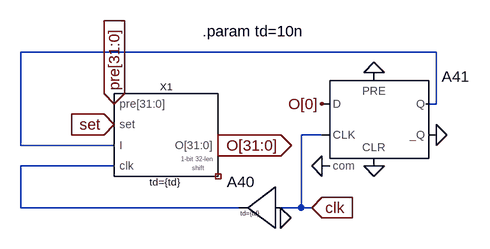
[diagram p0: schematic ring-shift_reg-1bit-32len.asc]
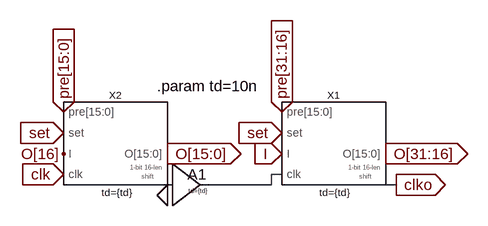
[diagram p1: sub-circuit shift_reg-1bit-32len.asc]
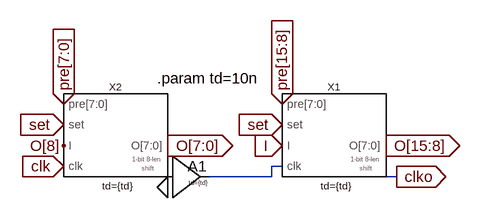
[diagram p2: sub-circuit shift_reg-1bit-16len.asc]
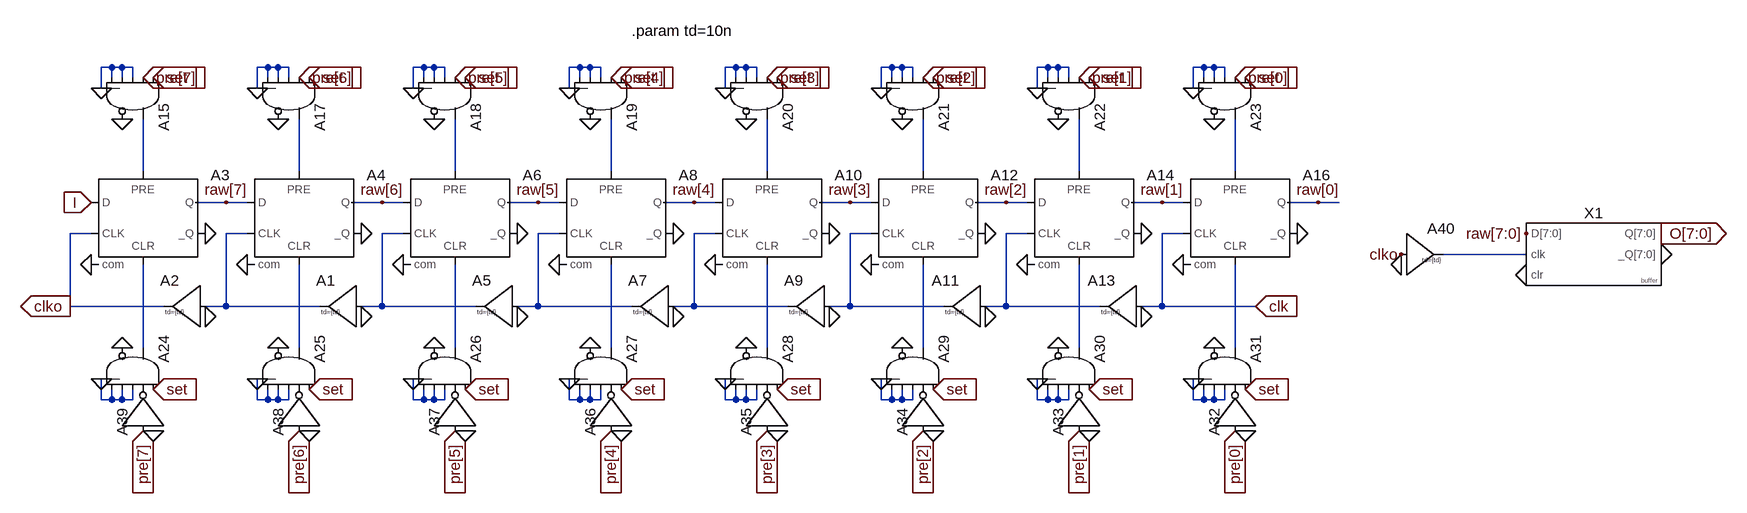
[diagram p3: sub-circuit shift_reg-1bit-8len.asc]
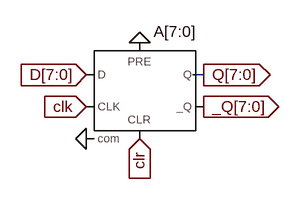
[diagram p4: sub-circuit dbuf_8bit.asc]
ring-shift_reg-1bit-32len.asc, the LTspice schematic file:
Version 4
SHEET 1 2236 680
WIRE 1680 -160 1040 -160
WIRE 1680 -80 1680 -160
WIRE 1680 -80 1664 -80
WIRE 1504 -32 1472 -32
WIRE 1040 -16 1040 -160
WIRE 1184 -16 1040 -16
WIRE 1184 16 1040 16
WIRE 1040 80 1040 16
WIRE 1376 80 1040 80
WIRE 1472 80 1472 -32
WIRE 1472 80 1440 80
WIRE 1488 80 1472 80
FLAG 1488 80 clk
IOPIN 1488 80 In
FLAG 1344 -16 O[31:0]
IOPIN 1344 -16 Out
FLAG 1184 -80 pre[31:0]
IOPIN 1184 -80 In
FLAG 1184 -48 set
IOPIN 1184 -48 In
FLAG 1440 96 0
FLAG 1504 16 0
FLAG 1584 16 0
FLAG 1584 -128 0
FLAG 1680 -32 0
FLAG 1504 -80 O[0]
SYMBOL Digital\\buf1 1440 16 M0
WINDOW 3 32 73 Left 0
SYMATTR Value td={td}
SYMATTR InstName A40
SYMBOL Digital\\dflop 1584 -128 R0
SYMATTR InstName A41
SYMBOL shift_reg-1bit-32len 1264 -32 R0
WINDOW 39 -2 83 Bottom 1
SYMATTR InstName X1
SYMATTR SpiceLine td={td}
TEXT 1320 -192 Left 2 !.param td=10n

shift_reg-1bit-32len.asc, the sub-circuit schematic file:
Version 4
SHEET 1 2236 680
WIRE 736 64 720 64
WIRE 720 80 720 64
WIRE 720 80 624 80
WIRE 912 80 896 80
FLAG 400 64 clk
IOPIN 400 64 In
FLAG 896 32 O[31:16]
IOPIN 896 32 Out
FLAG 736 -32 pre[31:16]
IOPIN 736 -32 In
FLAG 736 0 set
IOPIN 736 0 In
FLAG 912 80 clko
IOPIN 912 80 Out
FLAG 736 32 I
IOPIN 736 32 In
FLAG 560 96 0
FLAG 560 32 O[15:0]
IOPIN 560 32 Out
FLAG 400 -32 pre[15:0]
IOPIN 400 -32 In
FLAG 400 0 set
IOPIN 400 0 In
FLAG 400 32 O[16]
SYMBOL Digital\\buf1 560 16 R0
WINDOW 3 32 73 Left 0
WINDOW 0 31 48 Left 2
SYMATTR Value td={td}
SYMATTR InstName A1
SYMBOL shift_reg-1bit-16len 816 16 R0
WINDOW 39 2 86 Bottom 1
SYMATTR InstName X1
SYMATTR SpiceLine td={td}
SYMBOL shift_reg-1bit-16len 480 16 R0
WINDOW 39 2 86 Bottom 1
SYMATTR InstName X2
SYMATTR SpiceLine td={td}
TEXT 544 -72 Left 2 !.param td=10n

shift_reg-1bit-16len.asc, the sub-circuit schematic file:
Version 4
SHEET 1 2236 680
WIRE 736 64 720 64
WIRE 720 80 720 64
WIRE 720 80 624 80
WIRE 912 80 896 80
FLAG 400 64 clk
IOPIN 400 64 In
FLAG 896 32 O[15:8]
IOPIN 896 32 Out
FLAG 736 -32 pre[15:8]
IOPIN 736 -32 In
FLAG 736 0 set
IOPIN 736 0 In
FLAG 912 80 clko
IOPIN 912 80 Out
FLAG 736 32 I
IOPIN 736 32 In
FLAG 560 96 0
FLAG 560 32 O[7:0]
IOPIN 560 32 Out
FLAG 400 -32 pre[7:0]
IOPIN 400 -32 In
FLAG 400 0 set
IOPIN 400 0 In
FLAG 400 32 O[8]
SYMBOL shift_reg-1bit-8len 816 16 R0
WINDOW 39 3 88 Bottom 1
SYMATTR SpiceLine td={td}
SYMATTR InstName X1
SYMBOL Digital\\buf1 560 16 R0
WINDOW 3 32 73 Left 0
WINDOW 0 31 48 Left 2
SYMATTR Value td={td}
SYMATTR InstName A1
SYMBOL shift_reg-1bit-8len 480 16 R0
WINDOW 39 3 88 Bottom 1
SYMATTR SpiceLine td={td}
SYMATTR InstName X2
TEXT 544 -72 Left 2 !.param td=10n

shift_reg-1bit-8len.asc, the sub-circuit schematic file:
Version 4
SHEET 1 2616 680
WIRE 96 -288 80 -288
WIRE 112 -288 96 -288
WIRE 128 -288 112 -288
WIRE 336 -288 320 -288
WIRE 352 -288 336 -288
WIRE 368 -288 352 -288
WIRE 576 -288 560 -288
WIRE 592 -288 576 -288
WIRE 608 -288 592 -288
WIRE 816 -288 800 -288
WIRE 832 -288 816 -288
WIRE 848 -288 832 -288
WIRE 1056 -288 1040 -288
WIRE 1072 -288 1056 -288
WIRE 1088 -288 1072 -288
WIRE 1296 -288 1280 -288
WIRE 1312 -288 1296 -288
WIRE 1328 -288 1312 -288
WIRE 1536 -288 1520 -288
WIRE 1552 -288 1536 -288
WIRE 1568 -288 1552 -288
WIRE 1776 -288 1760 -288
WIRE 1792 -288 1776 -288
WIRE 1808 -288 1792 -288
WIRE 96 -272 96 -288
WIRE 112 -272 112 -288
WIRE 128 -272 128 -288
WIRE 336 -272 336 -288
WIRE 352 -272 352 -288
WIRE 368 -272 368 -288
WIRE 576 -272 576 -288
WIRE 592 -272 592 -288
WIRE 608 -272 608 -288
WIRE 816 -272 816 -288
WIRE 832 -272 832 -288
WIRE 848 -272 848 -288
WIRE 1056 -272 1056 -288
WIRE 1072 -272 1072 -288
WIRE 1088 -272 1088 -288
WIRE 1296 -272 1296 -288
WIRE 1312 -272 1312 -288
WIRE 1328 -272 1328 -288
WIRE 1536 -272 1536 -288
WIRE 1552 -272 1552 -288
WIRE 1568 -272 1568 -288
WIRE 1776 -272 1776 -288
WIRE 1792 -272 1792 -288
WIRE 1808 -272 1808 -288
WIRE 80 -256 80 -288
WIRE 96 -256 80 -256
WIRE 320 -256 320 -288
WIRE 336 -256 320 -256
WIRE 560 -256 560 -288
WIRE 576 -256 560 -256
WIRE 800 -256 800 -288
WIRE 816 -256 800 -256
WIRE 1040 -256 1040 -288
WIRE 1056 -256 1040 -256
WIRE 1280 -256 1280 -288
WIRE 1296 -256 1280 -256
WIRE 1520 -256 1520 -288
WIRE 1536 -256 1520 -256
WIRE 1760 -256 1760 -288
WIRE 1776 -256 1760 -256
WIRE 144 -128 144 -208
WIRE 384 -128 384 -208
WIRE 624 -128 624 -208
WIRE 864 -128 864 -208
WIRE 1104 -128 1104 -208
WIRE 1344 -128 1344 -208
WIRE 1584 -128 1584 -208
WIRE 1824 -128 1824 -208
WIRE 272 -80 224 -80
WIRE 304 -80 272 -80
WIRE 512 -80 464 -80
WIRE 544 -80 512 -80
WIRE 752 -80 704 -80
WIRE 784 -80 752 -80
WIRE 992 -80 944 -80
WIRE 1024 -80 992 -80
WIRE 1232 -80 1184 -80
WIRE 1264 -80 1232 -80
WIRE 1472 -80 1424 -80
WIRE 1504 -80 1472 -80
WIRE 1712 -80 1664 -80
WIRE 1744 -80 1712 -80
WIRE 1952 -80 1904 -80
WIRE 1984 -80 1952 -80
WIRE 64 -32 32 -32
WIRE 304 -32 272 -32
WIRE 544 -32 512 -32
WIRE 784 -32 752 -32
WIRE 1024 -32 992 -32
WIRE 1264 -32 1232 -32
WIRE 1504 -32 1472 -32
WIRE 1744 -32 1712 -32
WIRE 2272 0 2144 0
WIRE 32 80 32 -32
WIRE 176 80 32 80
WIRE 272 80 272 -32
WIRE 272 80 240 80
WIRE 416 80 272 80
WIRE 512 80 512 -32
WIRE 512 80 480 80
WIRE 656 80 512 80
WIRE 752 80 752 -32
WIRE 752 80 720 80
WIRE 896 80 752 80
WIRE 992 80 992 -32
WIRE 992 80 960 80
WIRE 1136 80 992 80
WIRE 1232 80 1232 -32
WIRE 1232 80 1200 80
WIRE 1376 80 1232 80
WIRE 1472 80 1472 -32
WIRE 1472 80 1440 80
WIRE 1616 80 1472 80
WIRE 1712 80 1712 -32
WIRE 1712 80 1680 80
WIRE 1856 80 1712 80
WIRE 144 144 144 16
WIRE 384 144 384 16
WIRE 624 144 624 16
WIRE 864 144 864 16
WIRE 1104 144 1104 16
WIRE 1344 144 1344 16
WIRE 1584 144 1584 16
WIRE 1824 144 1824 16
WIRE 96 192 80 192
WIRE 336 192 320 192
WIRE 576 192 560 192
WIRE 816 192 800 192
WIRE 1056 192 1040 192
WIRE 1296 192 1280 192
WIRE 1536 192 1520 192
WIRE 1776 192 1760 192
WIRE 80 224 80 192
WIRE 96 224 96 208
WIRE 96 224 80 224
WIRE 112 224 112 208
WIRE 112 224 96 224
WIRE 128 224 128 208
WIRE 128 224 112 224
WIRE 320 224 320 192
WIRE 336 224 336 208
WIRE 336 224 320 224
WIRE 352 224 352 208
WIRE 352 224 336 224
WIRE 368 224 368 208
WIRE 368 224 352 224
WIRE 560 224 560 192
WIRE 576 224 576 208
WIRE 576 224 560 224
WIRE 592 224 592 208
WIRE 592 224 576 224
WIRE 608 224 608 208
WIRE 608 224 592 224
WIRE 800 224 800 192
WIRE 816 224 816 208
WIRE 816 224 800 224
WIRE 832 224 832 208
WIRE 832 224 816 224
WIRE 848 224 848 208
WIRE 848 224 832 224
WIRE 1040 224 1040 192
WIRE 1056 224 1056 208
WIRE 1056 224 1040 224
WIRE 1072 224 1072 208
WIRE 1072 224 1056 224
WIRE 1088 224 1088 208
WIRE 1088 224 1072 224
WIRE 1280 224 1280 192
WIRE 1296 224 1296 208
WIRE 1296 224 1280 224
WIRE 1312 224 1312 208
WIRE 1312 224 1296 224
WIRE 1328 224 1328 208
WIRE 1328 224 1312 224
WIRE 1520 224 1520 192
WIRE 1536 224 1536 208
WIRE 1536 224 1520 224
WIRE 1552 224 1552 208
WIRE 1552 224 1536 224
WIRE 1568 224 1568 208
WIRE 1568 224 1552 224
WIRE 1760 224 1760 192
WIRE 1776 224 1776 208
WIRE 1776 224 1760 224
WIRE 1792 224 1792 208
WIRE 1792 224 1776 224
WIRE 1808 224 1808 208
WIRE 1808 224 1792 224
FLAG 1856 80 clk
IOPIN 1856 80 In
FLAG 240 96 0
FLAG 1952 -80 raw[0]
FLAG 144 -272 pre[7]
IOPIN 144 -272 In
FLAG 64 16 0
FLAG 240 -32 0
FLAG 480 96 0
FLAG 384 -272 pre[6]
IOPIN 384 -272 In
FLAG 304 16 0
FLAG 480 -32 0
FLAG 720 96 0
FLAG 624 -272 pre[5]
IOPIN 624 -272 In
FLAG 544 16 0
FLAG 720 -32 0
FLAG 960 96 0
FLAG 864 -272 pre[4]
IOPIN 864 -272 In
FLAG 784 16 0
FLAG 960 -32 0
FLAG 1200 96 0
FLAG 1104 -272 pre[3]
IOPIN 1104 -272 In
FLAG 1024 16 0
FLAG 1200 -32 0
FLAG 1440 96 0
FLAG 1344 -272 pre[2]
IOPIN 1344 -272 In
FLAG 1264 16 0
FLAG 1440 -32 0
FLAG 1680 96 0
FLAG 1584 -272 pre[1]
IOPIN 1584 -272 In
FLAG 1504 16 0
FLAG 1680 -32 0
FLAG 1824 -272 pre[0]
IOPIN 1824 -272 In
FLAG 1744 16 0
FLAG 1920 -32 0
FLAG 160 -272 set
IOPIN 160 -272 In
FLAG 80 -256 0
FLAG 400 -272 set
IOPIN 400 -272 In
FLAG 320 -256 0
FLAG 640 -272 set
IOPIN 640 -272 In
FLAG 560 -256 0
FLAG 880 -272 set
IOPIN 880 -272 In
FLAG 800 -256 0
FLAG 1120 -272 set
IOPIN 1120 -272 In
FLAG 1040 -256 0
FLAG 1360 -272 set
IOPIN 1360 -272 In
FLAG 1280 -256 0
FLAG 1600 -272 set
IOPIN 1600 -272 In
FLAG 1520 -256 0
FLAG 1840 -272 set
IOPIN 1840 -272 In
FLAG 1760 -256 0
FLAG 144 272 pre[7]
IOPIN 144 272 In
FLAG 384 272 pre[6]
IOPIN 384 272 In
FLAG 624 272 pre[5]
IOPIN 624 272 In
FLAG 864 272 pre[4]
IOPIN 864 272 In
FLAG 1104 272 pre[3]
IOPIN 1104 272 In
FLAG 1344 272 pre[2]
IOPIN 1344 272 In
FLAG 1584 272 pre[1]
IOPIN 1584 272 In
FLAG 1824 272 pre[0]
IOPIN 1824 272 In
FLAG 160 208 set
IOPIN 160 208 In
FLAG 80 192 0
FLAG 400 208 set
IOPIN 400 208 In
FLAG 320 192 0
FLAG 640 208 set
IOPIN 640 208 In
FLAG 560 192 0
FLAG 880 208 set
IOPIN 880 208 In
FLAG 800 192 0
FLAG 1120 208 set
IOPIN 1120 208 In
FLAG 1040 192 0
FLAG 1360 208 set
IOPIN 1360 208 In
FLAG 1280 192 0
FLAG 1600 208 set
IOPIN 1600 208 In
FLAG 1520 192 0
FLAG 1840 208 set
IOPIN 1840 208 In
FLAG 1760 192 0
FLAG 112 -208 0
FLAG 352 -208 0
FLAG 592 -208 0
FLAG 832 -208 0
FLAG 1072 -208 0
FLAG 1312 -208 0
FLAG 1552 -208 0
FLAG 1792 -208 0
FLAG 112 144 0
FLAG 352 144 0
FLAG 592 144 0
FLAG 832 144 0
FLAG 1072 144 0
FLAG 1312 144 0
FLAG 1552 144 0
FLAG 1792 144 0
FLAG 1840 272 0
FLAG 1600 272 0
FLAG 1360 272 0
FLAG 1120 272 0
FLAG 880 272 0
FLAG 640 272 0
FLAG 400 272 0
FLAG 160 272 0
FLAG 64 -80 I
IOPIN 64 -80 In
FLAG 32 80 clko
IOPIN 32 80 Out
FLAG 2272 32 0
FLAG 2080 16 0
FLAG 2080 0 clko
FLAG 2272 -32 raw[7:0]
FLAG 2480 0 0
FLAG 2480 -32 O[7:0]
IOPIN 2480 -32 Out
FLAG 1712 -80 raw[1]
FLAG 1472 -80 raw[2]
FLAG 1232 -80 raw[3]
FLAG 992 -80 raw[4]
FLAG 752 -80 raw[5]
FLAG 512 -80 raw[6]
FLAG 272 -80 raw[7]
SYMBOL Digital\\buf1 240 16 M0
WINDOW 3 32 73 Left 0
SYMATTR Value td={td}
SYMATTR InstName A2
SYMBOL Digital\\dflop 144 -128 R0
SYMATTR InstName A3
SYMBOL Digital\\buf1 480 16 M0
WINDOW 3 32 73 Left 0
SYMATTR Value td={td}
SYMATTR InstName A1
SYMBOL Digital\\dflop 384 -128 R0
SYMATTR InstName A4
SYMBOL Digital\\buf1 720 16 M0
WINDOW 3 32 73 Left 0
SYMATTR Value td={td}
SYMATTR InstName A5
SYMBOL Digital\\dflop 624 -128 R0
SYMATTR InstName A6
SYMBOL Digital\\buf1 960 16 M0
WINDOW 3 32 73 Left 0
SYMATTR Value td={td}
SYMATTR InstName A7
SYMBOL Digital\\dflop 864 -128 R0
SYMATTR InstName A8
SYMBOL Digital\\buf1 1200 16 M0
WINDOW 3 32 73 Left 0
SYMATTR Value td={td}
SYMATTR InstName A9
SYMBOL Digital\\dflop 1104 -128 R0
SYMATTR InstName A10
SYMBOL Digital\\buf1 1440 16 M0
WINDOW 3 32 73 Left 0
SYMATTR Value td={td}
SYMATTR InstName A11
SYMBOL Digital\\dflop 1344 -128 R0
SYMATTR InstName A12
SYMBOL Digital\\buf1 1680 16 M0
WINDOW 3 32 73 Left 0
SYMATTR Value td={td}
SYMATTR InstName A13
SYMBOL Digital\\dflop 1584 -128 R0
SYMATTR InstName A14
SYMBOL Digital\\dflop 1824 -128 R0
SYMATTR InstName A16
SYMBOL Digital\\and 192 -240 R90
SYMATTR InstName A15
SYMBOL Digital\\and 432 -240 R90
SYMATTR InstName A17
SYMBOL Digital\\and 672 -240 R90
SYMATTR InstName A18
SYMBOL Digital\\and 912 -240 R90
SYMATTR InstName A19
SYMBOL Digital\\and 1152 -240 R90
SYMATTR InstName A20
SYMBOL Digital\\and 1392 -240 R90
SYMATTR InstName A21
SYMBOL Digital\\and 1632 -240 R90
SYMATTR InstName A22
SYMBOL Digital\\and 1872 -240 R90
SYMATTR InstName A23
SYMBOL Digital\\and 192 176 M270
SYMATTR InstName A24
SYMBOL Digital\\and 432 176 M270
SYMATTR InstName A25
SYMBOL Digital\\and 672 176 M270
SYMATTR InstName A26
SYMBOL Digital\\and 912 176 M270
SYMATTR InstName A27
SYMBOL Digital\\and 1152 176 M270
SYMATTR InstName A28
SYMBOL Digital\\and 1392 176 M270
SYMATTR InstName A29
SYMBOL Digital\\and 1632 176 M270
SYMATTR InstName A30
SYMBOL Digital\\and 1872 176 M270
SYMATTR InstName A31
SYMBOL Digital\\inv 1760 272 R270
WINDOW 0 -8 32 Left 2
SYMATTR InstName A32
SYMBOL Digital\\inv 1520 272 R270
WINDOW 0 -8 32 Left 2
SYMATTR InstName A33
SYMBOL Digital\\inv 1280 272 R270
WINDOW 0 -8 32 Left 2
SYMATTR InstName A34
SYMBOL Digital\\inv 1040 272 R270
WINDOW 0 -8 32 Left 2
SYMATTR InstName A35
SYMBOL Digital\\inv 800 272 R270
WINDOW 0 -8 32 Left 2
SYMATTR InstName A36
SYMBOL Digital\\inv 560 272 R270
WINDOW 0 -8 32 Left 2
SYMATTR InstName A37
SYMBOL Digital\\inv 320 272 R270
WINDOW 0 -8 32 Left 2
SYMATTR InstName A38
SYMBOL Digital\\inv 80 272 R270
WINDOW 0 -8 32 Left 2
SYMATTR InstName A39
SYMBOL dbuf_8bit 2368 0 R0
SYMATTR InstName X1
SYMBOL Digital\\buf1 2080 -64 R0
WINDOW 3 32 73 Left 0
SYMATTR Value td={td}
SYMATTR InstName A40
TEXT 896 -344 Left 2 !.param td=10n

dbuf_8bit.asc, the sub-circuit schematic file:
Version 4
SHEET 1 880 680
WIRE 224 128 208 128
FLAG 48 224 0
FLAG 224 128 Q[7:0]
IOPIN 224 128 Out
FLAG 224 176 _Q[7:0]
IOPIN 224 176 Out
FLAG 128 224 clr
IOPIN 128 224 In
FLAG 48 128 D[7:0]
IOPIN 48 128 In
FLAG 48 176 clk
IOPIN 48 176 In
FLAG 128 80 0
SYMBOL Digital\\dflop 128 80 R0
WINDOW 0 21 -17 Left 2
SYMATTR InstName A[7:0]

The netlist it stands for:
* ring-shift_reg-1bit-32len.asc
A40 clk 0 0 0 0 0 N002 0 BUF td={td}
A41 O[0] 0 clk 0 0 0 N001 0 DFLOP
XX1 N002 pre[31] pre[30] pre[29] pre[28] pre[27] pre[26] pre[25] pre[24] pre[23] pre[22] pre[21] pre[20] pre[19] pre[18] pre[17] pre[16] pre[15] pre[14] pre[13] pre[12] pre[11] pre[10] pre[9] pre[8] pre[7] pre[6] pre[5] pre[4] pre[3] pre[2] pre[1] pre[0] O[31] O[30] O[29] O[28] O[27] O[26] O[25] O[24] O[23] O[22] O[21] O[20] O[19] O[18] O[17] O[16] O[15] O[14] O[13] O[12] O[11] O[10] O[9] O[8] O[7] O[6] O[5] O[4] O[3] O[2] O[1] O[0] set N001 NC_01 shift_reg-1bit-32len params: td={td}

* block symbol definitions
.subckt shift_reg-1bit-32len clk pre[31] pre[30] pre[29] pre[28] pre[27] pre[26] pre[25] pre[24] pre[23] pre[22] pre[21] pre[20] pre[19] pre[18] pre[17] pre[16] pre[15] pre[14] pre[13] pre[12] pre[11] pre[10] pre[9] pre[8] pre[7] pre[6] pre[5] pre[4] pre[3] pre[2] pre[1] pre[0] O[31] O[30] O[29] O[28] O[27] O[26] O[25] O[24] O[23] O[22] O[21] O[20] O[19] O[18] O[17] O[16] O[15] O[14] O[13] O[12] O[11] O[10] O[9] O[8] O[7] O[6] O[5] O[4] O[3] O[2] O[1] O[0] set I clko
A1 P001 0 0 0 0 0 N001 0 BUF td={td}
XX1 N001 pre[31] pre[30] pre[29] pre[28] pre[27] pre[26] pre[25] pre[24] pre[23] pre[22] pre[21] pre[20] pre[19] pre[18] pre[17] pre[16] O[31] O[30] O[29] O[28] O[27] O[26] O[25] O[24] O[23] O[22] O[21] O[20] O[19] O[18] O[17] O[16] set I clko shift_reg-1bit-16len params: td={td}
XX2 clk pre[15] pre[14] pre[13] pre[12] pre[11] pre[10] pre[9] pre[8] pre[7] pre[6] pre[5] pre[4] pre[3] pre[2] pre[1] pre[0] O[15] O[14] O[13] O[12] O[11] O[10] O[9] O[8] O[7] O[6] O[5] O[4] O[3] O[2] O[1] O[0] set O[16] P001 shift_reg-1bit-16len params: td={td}
.param td=10n
.ends shift_reg-1bit-32len

.subckt shift_reg-1bit-16len clk pre[15] pre[14] pre[13] pre[12] pre[11] pre[10] pre[9] pre[8] pre[7] pre[6] pre[5] pre[4] pre[3] pre[2] pre[1] pre[0] O[15] O[14] O[13] O[12] O[11] O[10] O[9] O[8] O[7] O[6] O[5] O[4] O[3] O[2] O[1] O[0] set I clko
XX1 N001 pre[15] pre[14] pre[13] pre[12] pre[11] pre[10] pre[9] pre[8] O[15] O[14] O[13] O[12] O[11] O[10] O[9] O[8] set I clko shift_reg-1bit-8len params: td={td}
A1 P001 0 0 0 0 0 N001 0 BUF td={td}
XX2 clk pre[7] pre[6] pre[5] pre[4] pre[3] pre[2] pre[1] pre[0] O[7] O[6] O[5] O[4] O[3] O[2] O[1] O[0] set O[8] P001 shift_reg-1bit-8len params: td={td}
.param td=10n
.ends shift_reg-1bit-16len

.subckt shift_reg-1bit-8len clk pre[7] pre[6] pre[5] pre[4] pre[3] pre[2] pre[1] pre[0] O[7] O[6] O[5] O[4] O[3] O[2] O[1] O[0] set I clko
A2 N009 0 0 0 0 0 clko 0 BUF td={td}
A3 I 0 clko N001 N016 0 raw[7] 0 DFLOP
A1 N010 0 0 0 0 0 N009 0 BUF td={td}
A4 raw[7] 0 N009 N002 N017 0 raw[6] 0 DFLOP
A5 N011 0 0 0 0 0 N010 0 BUF td={td}
A6 raw[6] 0 N010 N003 N018 0 raw[5] 0 DFLOP
A7 N012 0 0 0 0 0 N011 0 BUF td={td}
A8 raw[5] 0 N011 N004 N019 0 raw[4] 0 DFLOP
A9 N013 0 0 0 0 0 N012 0 BUF td={td}
A10 raw[4] 0 N012 N005 N020 0 raw[3] 0 DFLOP
A11 N014 0 0 0 0 0 N013 0 BUF td={td}
A12 raw[3] 0 N013 N006 N021 0 raw[2] 0 DFLOP
A13 clk 0 0 0 0 0 N014 0 BUF td={td}
A14 raw[2] 0 N014 N007 N022 0 raw[1] 0 DFLOP
A16 raw[1] 0 clk N008 N023 0 raw[0] 0 DFLOP
A15 set pre[7] 0 0 0 0 N001 0 AND
A17 set pre[6] 0 0 0 0 N002 0 AND
A18 set pre[5] 0 0 0 0 N003 0 AND
A19 set pre[4] 0 0 0 0 N004 0 AND
A20 set pre[3] 0 0 0 0 N005 0 AND
A21 set pre[2] 0 0 0 0 N006 0 AND
A22 set pre[1] 0 0 0 0 N007 0 AND
A23 set pre[0] 0 0 0 0 N008 0 AND
A24 set P001 0 0 0 0 N016 0 AND
A25 set P002 0 0 0 0 N017 0 AND
A26 set P003 0 0 0 0 N018 0 AND
A27 set P004 0 0 0 0 N019 0 AND
A28 set P005 0 0 0 0 N020 0 AND
A29 set P006 0 0 0 0 N021 0 AND
A30 set P007 0 0 0 0 N022 0 AND
A31 set P008 0 0 0 0 N023 0 AND
A32 pre[0] 0 0 0 0 P008 0 0 BUF
A33 pre[1] 0 0 0 0 P007 0 0 BUF
A34 pre[2] 0 0 0 0 P006 0 0 BUF
A35 pre[3] 0 0 0 0 P005 0 0 BUF
A36 pre[4] 0 0 0 0 P004 0 0 BUF
A37 pre[5] 0 0 0 0 P003 0 0 BUF
A38 pre[6] 0 0 0 0 P002 0 0 BUF
A39 pre[7] 0 0 0 0 P001 0 0 BUF
XX1 N015 0 raw[7] raw[6] raw[5] raw[4] raw[3] raw[2] raw[1] raw[0] 0 0 0 0 0 0 0 0 O[7] O[6] O[5] O[4] O[3] O[2] O[1] O[0] dbuf_8bit
A40 clko 0 0 0 0 0 N015 0 BUF td={td}
.param td=10n
.ends shift_reg-1bit-8len

.subckt dbuf_8bit clk clr D[7] D[6] D[5] D[4] D[3] D[2] D[1] D[0] _Q[7] _Q[6] _Q[5] _Q[4] _Q[3] _Q[2] _Q[1] _Q[0] Q[7] Q[6] Q[5] Q[4] Q[3] Q[2] Q[1] Q[0]
A[7:0] D[7:0] 0 clk 0 clr _Q[7:0] Q[7:0] 0 DFLOP
.ends dbuf_8bit

.param td=10n
.backanno
.end